# Altium project Guppy Buddy Rev B.PrjPCB (part 5 of 9)

## Sheet User Interface.SchDoc: User Interface
size Tabloid; ApprovedBy: NA; CompanyName: Cospan Design LLC; DrawnBy: David McCoy; Engineer: David McCoy; DocumentNumber: 8; Revision: A; SheetNumber: 8; SheetTotal: 18; Client: OSH; Project: Guppy Buddy; ProjectPrettyName: Guppy Buddy
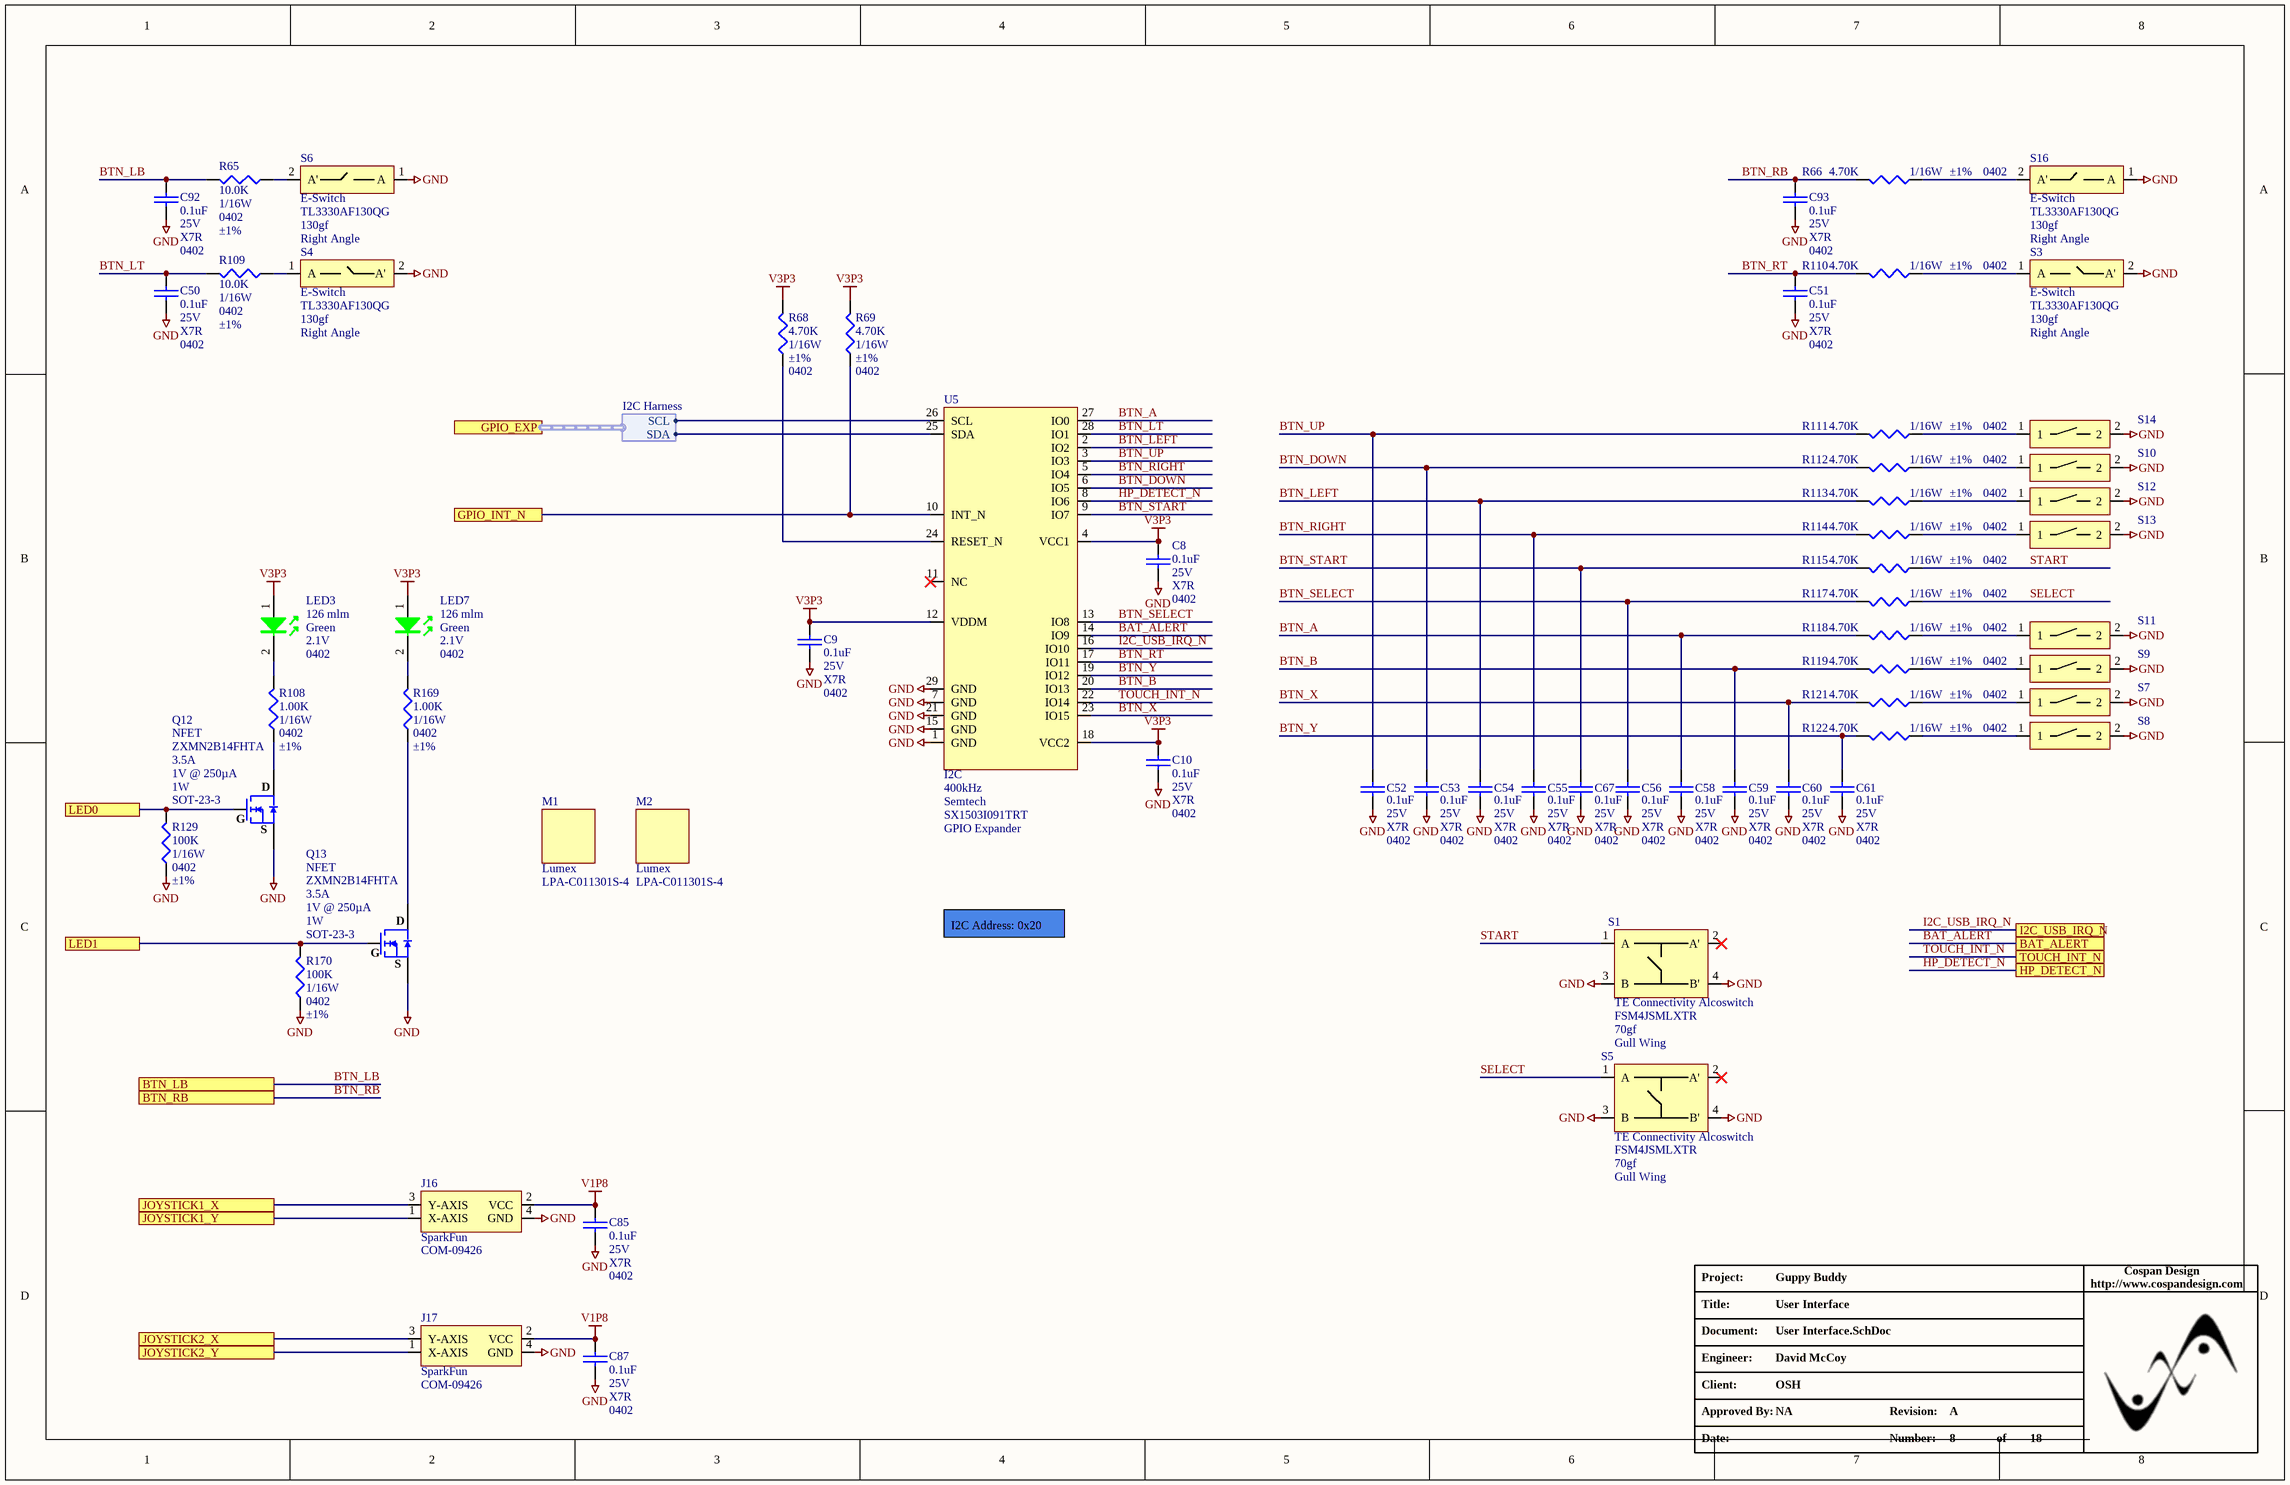
[diagram p7: User Interface.SchDoc]

### Parts
C8  Capacitance: 0.1uF  Voltage - Rated: 25V  Temperature Coefficient: X7R  Package / Case: 0402  [C_0402]  (hidden comment: C_0402_0.1UF_25V)
C9  Capacitance: 0.1uF  Voltage - Rated: 25V  Temperature Coefficient: X7R  Package / Case: 0402  [C_0402]  (hidden comment: C_0402_0.1UF_25V)
C10  Capacitance: 0.1uF  Voltage - Rated: 25V  Temperature Coefficient: X7R  Package / Case: 0402  [C_0402]  (hidden comment: C_0402_0.1UF_25V)
C50  Capacitance: 0.1uF  Voltage - Rated: 25V  Temperature Coefficient: X7R  Package / Case: 0402  [C_0402]  (hidden comment: C_0402_0.1UF_25V)
C51  Capacitance: 0.1uF  Voltage - Rated: 25V  Temperature Coefficient: X7R  Package / Case: 0402  [C_0402]  (hidden comment: C_0402_0.1UF_25V)
C52  Capacitance: 0.1uF  Voltage - Rated: 25V  Temperature Coefficient: X7R  Package / Case: 0402  [C_0402]  (hidden comment: C_0402_0.1UF_25V)
C53  Capacitance: 0.1uF  Voltage - Rated: 25V  Temperature Coefficient: X7R  Package / Case: 0402  [C_0402]  (hidden comment: C_0402_0.1UF_25V)
C54  Capacitance: 0.1uF  Voltage - Rated: 25V  Temperature Coefficient: X7R  Package / Case: 0402  [C_0402]  (hidden comment: C_0402_0.1UF_25V)
C55  Capacitance: 0.1uF  Voltage - Rated: 25V  Temperature Coefficient: X7R  Package / Case: 0402  [C_0402]  (hidden comment: C_0402_0.1UF_25V)
C56  Capacitance: 0.1uF  Voltage - Rated: 25V  Temperature Coefficient: X7R  Package / Case: 0402  [C_0402]  (hidden comment: C_0402_0.1UF_25V)
C58  Capacitance: 0.1uF  Voltage - Rated: 25V  Temperature Coefficient: X7R  Package / Case: 0402  [C_0402]  (hidden comment: C_0402_0.1UF_25V)
C59  Capacitance: 0.1uF  Voltage - Rated: 25V  Temperature Coefficient: X7R  Package / Case: 0402  [C_0402]  (hidden comment: C_0402_0.1UF_25V)
C60  Capacitance: 0.1uF  Voltage - Rated: 25V  Temperature Coefficient: X7R  Package / Case: 0402  [C_0402]  (hidden comment: C_0402_0.1UF_25V)
C61  Capacitance: 0.1uF  Voltage - Rated: 25V  Temperature Coefficient: X7R  Package / Case: 0402  [C_0402]  (hidden comment: C_0402_0.1UF_25V)
C67  Capacitance: 0.1uF  Voltage - Rated: 25V  Temperature Coefficient: X7R  Package / Case: 0402  [C_0402]  (hidden comment: C_0402_0.1UF_25V)
C85  Capacitance: 0.1uF  Voltage - Rated: 25V  Temperature Coefficient: X7R  Package / Case: 0402  [C_0402]  (hidden comment: C_0402_0.1UF_25V)
C87  Capacitance: 0.1uF  Voltage - Rated: 25V  Temperature Coefficient: X7R  Package / Case: 0402  [C_0402]  (hidden comment: C_0402_0.1UF_25V)
C92  Capacitance: 0.1uF  Voltage - Rated: 25V  Temperature Coefficient: X7R  Package / Case: 0402  [C_0402]  (hidden comment: C_0402_0.1UF_25V)
C93  Capacitance: 0.1uF  Voltage - Rated: 25V  Temperature Coefficient: X7R  Package / Case: 0402  [C_0402]  (hidden comment: C_0402_0.1UF_25V)
J16  Manufacturer 1: SparkFun  Manufacturer Part Number 1: COM-09426  [JOYSTICK_PSP1000]  (hidden comment: J_PSP1000)
J17  Manufacturer 1: SparkFun  Manufacturer Part Number 1: COM-09426  [JOYSTICK_PSP1000]  (hidden comment: J_PSP1000)
LED3  Luminous Flux @ Current - Test: 126 mlm  Color: Green  Voltage - Forward (Vf) Typ: 2.1V  Package / Case: 0402  [DIOM1005X07L_GREEN]  (hidden comment: LED_GRN_0402)
LED7  Luminous Flux @ Current - Test: 126 mlm  Color: Green  Voltage - Forward (Vf) Typ: 2.1V  Package / Case: 0402  [DIOM1005X07L_GREEN]  (hidden comment: LED_GRN_0402)
M1  Manufacturer 1: Lumex  Manufacturer Part Number 1: LPA-C011301S-4  [SINGLE_LIGHT_PIPE]  (hidden comment: M_LIGHT_PIPE)  (no BOM)
M2  Manufacturer 1: Lumex  Manufacturer Part Number 1: LPA-C011301S-4  [SINGLE_LIGHT_PIPE]  (hidden comment: M_LIGHT_PIPE)  (no BOM)
Q12  NFET  Manufacturer Part Number: ZXMN2B14FHTA  Current - Continuous Drain (Id) @ 25° C: 3.5A  Vgs(th) (Max) @ Id: 1V @ 250µA  Power - Max: 1W  Package / Case: SOT-23-3  [SOT-23A]
Q13  NFET  Manufacturer Part Number: ZXMN2B14FHTA  Current - Continuous Drain (Id) @ 25° C: 3.5A  Vgs(th) (Max) @ Id: 1V @ 250µA  Power - Max: 1W  Package / Case: SOT-23-3  [SOT-23A]
R65  Resistance In Ohms: 10.0K  Power (Watts): 1/16W  Case: 0402  Tolerance: ±1%  [R_0402]  (hidden comment: R_0402_10.0K)
R66  Resistance In Ohms: 4.70K  Power (Watts): 1/16W  Tolerance: ±1%  Case: 0402  [R_0402]  (hidden comment: 4.7k Ohms)
R68  Resistance In Ohms: 4.70K  Power (Watts): 1/16W  Tolerance: ±1%  Case: 0402  [R_0402]  (hidden comment: 4.7k Ohms)
R69  Resistance In Ohms: 4.70K  Power (Watts): 1/16W  Tolerance: ±1%  Case: 0402  [R_0402]  (hidden comment: 4.7k Ohms)
R108  Resistance In Ohms: 1.00K  Power (Watts): 1/16W  Case: 0402  Tolerance: ±1%  [R_0402]  (hidden comment: 1.0k Ohms)
R109  Resistance In Ohms: 10.0K  Power (Watts): 1/16W  Case: 0402  Tolerance: ±1%  [R_0402]  (hidden comment: R_0402_10.0K)
R110  Resistance In Ohms: 4.70K  Power (Watts): 1/16W  Tolerance: ±1%  Case: 0402  [R_0402]  (hidden comment: 4.7k Ohms)
R111  Resistance In Ohms: 4.70K  Power (Watts): 1/16W  Tolerance: ±1%  Case: 0402  [R_0402]  (hidden comment: 4.7k Ohms)
R112  Resistance In Ohms: 4.70K  Power (Watts): 1/16W  Tolerance: ±1%  Case: 0402  [R_0402]  (hidden comment: 4.7k Ohms)
R113  Resistance In Ohms: 4.70K  Power (Watts): 1/16W  Tolerance: ±1%  Case: 0402  [R_0402]  (hidden comment: 4.7k Ohms)
R114  Resistance In Ohms: 4.70K  Power (Watts): 1/16W  Tolerance: ±1%  Case: 0402  [R_0402]  (hidden comment: 4.7k Ohms)
R115  Resistance In Ohms: 4.70K  Power (Watts): 1/16W  Tolerance: ±1%  Case: 0402  [R_0402]  (hidden comment: 4.7k Ohms)
R117  Resistance In Ohms: 4.70K  Power (Watts): 1/16W  Tolerance: ±1%  Case: 0402  [R_0402]  (hidden comment: 4.7k Ohms)
R118  Resistance In Ohms: 4.70K  Power (Watts): 1/16W  Tolerance: ±1%  Case: 0402  [R_0402]  (hidden comment: 4.7k Ohms)
R119  Resistance In Ohms: 4.70K  Power (Watts): 1/16W  Tolerance: ±1%  Case: 0402  [R_0402]  (hidden comment: 4.7k Ohms)
R121  Resistance In Ohms: 4.70K  Power (Watts): 1/16W  Tolerance: ±1%  Case: 0402  [R_0402]  (hidden comment: 4.7k Ohms)
R122  Resistance In Ohms: 4.70K  Power (Watts): 1/16W  Tolerance: ±1%  Case: 0402  [R_0402]  (hidden comment: 4.7k Ohms)
R129  Resistance In Ohms: 100K  Power (Watts): 1/16W  Case: 0402  Tolerance: ±1%  [R_0402]  (hidden comment: R_0402_100.0K)
R169  Resistance In Ohms: 1.00K  Power (Watts): 1/16W  Case: 0402  Tolerance: ±1%  [R_0402]  (hidden comment: 1.0k Ohms)
R170  Resistance In Ohms: 100K  Power (Watts): 1/16W  Case: 0402  Tolerance: ±1%  [R_0402]  (hidden comment: R_0402_100.0K)
S1  Manufacturer: TE Connectivity Alcoswitch  Manufacturer Part Number: FSM4JSMLXTR  Operating Force: 70gf  Termination: Gull Wing  [TACTILE_1571563_2]  (hidden comment: S_TACTILE_1571563_2_BUTTON)
S3  Manufacturer: E-Switch  Operating Force: 130gf  Orientation: Right Angle  [TL3330AF130QG]  (hidden comment: S_TACTILE_ RA_TL3330AF130QG_BUTTON)
S4  Manufacturer: E-Switch  Operating Force: 130gf  Orientation: Right Angle  [TL3330AF130QG]  (hidden comment: S_TACTILE_ RA_TL3330AF130QG_BUTTON)
S5  Manufacturer: TE Connectivity Alcoswitch  Manufacturer Part Number: FSM4JSMLXTR  Operating Force: 70gf  Termination: Gull Wing  [TACTILE_1571563_2]  (hidden comment: S_TACTILE_1571563_2_BUTTON)
S6  Manufacturer: E-Switch  Operating Force: 130gf  Orientation: Right Angle  [TL3330AF130QG]  (hidden comment: S_TACTILE_ RA_TL3330AF130QG_BUTTON)
S7  S_GB_BTN  [GB_BUTTON]  (value not drawn)  (no BOM)
S8  S_GB_BTN  [GB_BUTTON]  (value not drawn)  (no BOM)
S9  S_GB_BTN  [GB_BUTTON]  (value not drawn)  (no BOM)
S10  S_GB_BTN  [GB_BUTTON]  (value not drawn)  (no BOM)
S11  S_GB_BTN  [GB_BUTTON]  (value not drawn)  (no BOM)
S12  S_GB_BTN  [GB_BUTTON]  (value not drawn)  (no BOM)
S13  S_GB_BTN  [GB_BUTTON]  (value not drawn)  (no BOM)
S14  S_GB_BTN  [GB_BUTTON]  (value not drawn)  (no BOM)
S16  Manufacturer: E-Switch  Operating Force: 130gf  Orientation: Right Angle  [TL3330AF130QG]  (hidden comment: S_TACTILE_ RA_TL3330AF130QG_BUTTON)
U5  Interface: I2C  Frequency: 400kHz  Manufacturer 1: Semtech  Manufacturer Part Number 1: SX1503I091TRT  Short Desc: GPIO Expander  [QFN40P400X400X60_HS-29N]  (hidden comment: U_SX1503I091TRT)

### Ports
BAT_ALERT, BTN_LB, BTN_RB, GPIO_EXP (harness I2C Harness), GPIO_INT_N, HP_DETECT_N, I2C_USB_IRQ_N, JOYSTICK1_X, JOYSTICK1_Y, JOYSTICK2_X, JOYSTICK2_Y, LED0, LED1, TOUCH_INT_N

### Harnesses
I2C Harness: SCL, SDA

### Nets
GND: C8.1 C9.1 C10.1 C50.1 C51.1 C52.1 C53.1 C54.1 C55.1 C56.1 C58.1 C59.1 C60.1 C61.1 C67.1 C85.1 C87.1 C92.1 C93.1 J16.4(GND) J17.4(GND) Q12.2(S) Q13.2(S) R129.2 R170.2 S1.3(B) S1.4(B') S3.2(A') S4.2(A') S5.3(B) S5.4(B') S6.1(A) S7.2 S8.2 S9.2 S10.2 S11.2 S12.2 S13.2 S14.2 S16.1(A) U5.1(GND) U5.7(GND) U5.15(GND) U5.21(GND) U5.29(GND)
V1P8: C85.2 C87.2 J16.2(VCC) J17.2(VCC)
V3P3: C8.2 C9.2 C10.2 LED3.1 LED7.1 R68.1 R69.1 U5.4(VCC1) U5.12(VDDM) U5.18(VCC2)
ADC0: J16.3(Y-AXIS) ; port JOYSTICK1_X
ADC1: J16.1(X-AXIS) ; port JOYSTICK1_Y
ADC2: J17.1(X-AXIS) ; port JOYSTICK2_Y
ADC3: J17.3(Y-AXIS) ; port JOYSTICK2_X
BAT_ALERT: U5.14(IO9) ; port BAT_ALERT  [project net ALERT]
BTN_A: C58.2 R118.1 U5.27(IO0)
BTN_B: C59.2 R119.1 U5.20(IO13)
BTN_DOWN: C53.2 R112.1 U5.6(IO5)
BTN_LB: C92.2 R65.1 ; port BTN_LB
BTN_LEFT: C54.2 R113.1 U5.2(IO2)
BTN_LT: C50.2 R109.1 U5.28(IO1)
BTN_RB: C93.2 R66.1 ; port BTN_RB
BTN_RIGHT: C55.2 R114.1 U5.5(IO4)
BTN_RT: C51.2 R110.1 U5.17(IO11)
BTN_SELECT: C56.2 R117.1 U5.13(IO8)
BTN_START: C67.2 R115.1 U5.9(IO7)
BTN_UP: C52.2 R111.1 U5.3(IO3)
BTN_X: C60.2 R121.1 U5.23(IO15)
BTN_Y: C61.2 R122.1 U5.19(IO12)
GPIO_INT_N: R69.2 U5.10(INT_N) ; port GPIO_INT_N
HP_DETECT_N: U5.8(IO6) ; port HP_DETECT_N
I2C0_SCL: U5.26(SCL) ; port GPIO_EXP.SCL
I2C0_SDA: U5.25(SDA) ; port GPIO_EXP.SDA
I2C_USB_IRQ_N: U5.16(IO10) ; port I2C_USB_IRQ_N
LED0: Q12.1(G) R129.1 ; port LED0
LED1: Q13.1(G) R170.1 ; port LED1
SELECT: R117.2 S5.1(A)
START: R115.2 S1.1(A)
TOUCH_INT_N: U5.22(IO14) ; port TOUCH_INT_N
NetLED3_2: LED3.2 R108.1
NetLED7_2: LED7.2 R169.1
NetQ12_3: Q12.3(D) R108.2
NetQ13_3: Q13.3(D) R169.2
NetR65_2: R65.2 S6.2(A')
NetR66_2: R66.2 S16.2(A')
NetR68_2: R68.2 U5.24(RESET_N)
NetR109_2: R109.2 S4.1(A)
NetR110_2: R110.2 S3.1(A)
NetR111_2: R111.2 S14.1
NetR112_2: R112.2 S10.1
NetR113_2: R113.2 S12.1
NetR114_2: R114.2 S13.1
NetR118_2: R118.2 S11.1
NetR119_2: R119.2 S9.1
NetR121_2: R121.2 S7.1
NetR122_2: R122.2 S8.1

Not connected (* = marked no-connect by the designer): S1 2(A')*; S5 2(A')*; U5 11(NC)*

### Notes on the sheet
- I2C Address: 0x20
- Project:
- http://www.cospandesign.com
- Cospan Design
- Document:
- Engineer:
- Title:
- Client:
- Approved By:
- Revision:
- Date:
- Number:
- of

### Library data of the parts
C8-C10 C50-C56 C58-C61 C67 C85 C87 C92 C93 = C_0402_0.1UF_25V: as C86 on sheet SOM Power; ComponentLink1URL: https://product.tdk.com/info/en/catalog/datasheets/mlcc_commercial_general_en.pdf; ComponentLink1Description: https://product.tdk.com/info/en/catalog/datasheets/mlcc_commercial_general_en.pdf; Supplier 1: Digi-Key; Supplier Part Number 1: 311-2077-1-ND; Stock 1: 0; Pricing 1: 1=0.1, 10=0.048, 100=0.0215, 500=0.01534, 1000=0.01205, 2500=0.01095, 5000=0.01007 (USD); Mount: Surface Mount; Case/Package: 0402; Case Code (Imperial): 0402; Case Code (Metric): 1005; Min Operating Temperature: -55°C; Max Operating Temperature: 125°C; Voltage Rating: 25V; Voltage Rating (DC): 25V; Packaging: Tape and Reel; Dielectric: X7R; Termination: SMD/SMT; Composition: Ceramic; Length: 1mm; Height: 0.5mm; Width: 0.02inch; Thickness: 0.022inch; Depth: 0.5mm; Radiation Hardening: No; Lead Free: Lead Free; Halogen Free: Halogen Free; ComponentLink2URL: https://datasheet.ciiva.com/11464/upy-gphc-x7r-6-3v-to-50v-8-11464889.pdf; ComponentLink2Description: https://datasheet.ciiva.com/11464/upy-gphc-x7r-6-3v-to-50v-8-11464889.pdf; ComponentLink3URL: https://datasheet.ciiva.com/13210/upy-gphc-x7r-6-3v-to-50v-8-12304-13210908.pdf; ComponentLink3Description: https://datasheet.ciiva.com/13210/upy-gphc-x7r-6-3v-to-50v-8-12304-13210908.pdf; ComponentLink4URL: https://datasheet.ciiva.com/17437/upy-gphc-x7r-6-3v-to-50v-8-17437357.pdf; ComponentLink4Description: https://datasheet.ciiva.com/17437/upy-gphc-x7r-6-3v-to-50v-8-17437357.pdf
J16 J17 = J_PSP1000: THUMB SLIDE JOYSTICK; Supplier 1: Digi-Key; Supplier Part Number 1: 1568-1848-ND; Stock 1: 0; ComponentLink1URL: https://media.digikey.com/pdf/Data%20Sheets/Sparkfun%20PDFs/COM-09426_Web.pdf; ComponentLink1Description: https://media.digikey.com/pdf/Data%20Sheets/Sparkfun%20PDFs/COM-09426_Web.pdf
LED3 LED7 = LED_GRN_0402: LED 1X0.5MM 570NM GN WTR CLR SMD; Manufacturer: Kingbright Corp; Manufacturer Part Number: APHHS1005CGCK; Current - Test: 20mA; Wavelength - Peak: 574nm; Millicandela Rating: 40mcd; Lens Type: Clear; Lens Style/Size: Rectangle, 0.8mm x 0.5mm; Viewing Angle: 120°; Supplier 1: Digi-Key; Supplier Part Number 1: 754-1101-1-ND; RoHS: RoHS Compliant; Category: Optoelectronics; Stock 1: 3400; Pricing: 1=0.24, 10=0.176, 25=0.1412, 100=0.1293, 250=0.11752, 500=0.10576, 1000=0.094 (USD); Wavelength - Dominant: 570nm; Mounting Type: Surface Mount; Packaging: Cut Tape (CT); Size / Dimension: *; Height: *; ComponentLink1URL: http://www.us.kingbright.com/images/catalog/SPEC/APHHS1005CGCK.pdf; ComponentLink1Description: http://www.us.kingbright.com/images/catalog/SPEC/APHHS1005CGCK.pdf
M1 M2 = M_LIGHT_PIPE: LIGHT PIPE 4MM SINGLE VERT SMD; Description 1: LIGHT PIPE 4MM SINGLE VERT SMD; Stock 1: 9623; Mount: Press-Fit; Colour: Clear; Material: PC,Polycarbonate; Package Quantity: 1000; Element Configuration: Single; Length: 4mm; Lead Free: Lead Free; ComponentLink1URL: https://www.lumex.com/content/files/ProductAttachment/829201730304-LPA-C011301S-X.pdf; ComponentLink1Description: https://www.lumex.com/content/files/ProductAttachment/829201730304-LPA-C011301S-X.pdf; ComponentLink2URL: http://www.farnell.com/datasheets/1423946.pdf; ComponentLink2Description: http://www.farnell.com/datasheets/1423946.pdf; ComponentLink3URL: http://www.mouser.com/ds/2/244/LPA-C011301S-4-1135475.pdf; ComponentLink3Description: http://www.mouser.com/ds/2/244/LPA-C011301S-4-1135475.pdf; Supplier 1: Digi-Key; Supplier Part Number 1: 67-2199-ND; Pricing 1: 1=1.26, 10=1.027, 25=0.79, 100=0.711, 250=0.632, 500=0.5372, 1000=0.4424, 3000=0.42028, 5000=0.4108 (USD)
Q12 Q13 = Q_NFET_3.50A_SOT23: MOSFET N-CH 20V 3.5A SOT23-3; Manufacturer: Diodes Incorporated; FET Type: N-Channel; Rds On (Max) @ Id, Vgs: 55 mOhm @ 3.5A, 4.5V; Current - Continuous Drain (Id) @ 25°C: 3.5A (Ta); Drive Voltage (Max Rds On,  Min Rds On): 1.8V, 4.5V; Gate Charge (Qg) (Max) @ Vgs: 11nC @ 4.5V; Input Capacitance (Ciss) (Max) @ Vds: 872pF @ 10V; Vgs (Max): ±8V; Power Dissipation (Max): 1W (Ta); Supplier 1: Digi-Key; Supplier Part Number 1: ZXMN2B14FHCT-ND; RoHS: RoHS Compliant; Category: Discrete Semiconductor Products; Stock 1: 1379; FET Feature: -; Drain to Source Voltage (Vdss): 20V; Mounting Type: Surface Mount; Supplier Device Package: SOT-23-3; Packaging: Cut Tape (CT); ComponentLink1URL: http://www.diodes.com/_files/datasheets/ZXMN2B14FH.pdf; ComponentLink1Description: http://www.diodes.com/_files/datasheets/ZXMN2B14FH.pdf; Pricing 1: 1=0.78, 10=0.683, 100=0.5238, 500=0.41406, 1000=0.33125 (USD); Part Status: Active; Technology: MOSFET (Metal Oxide); Operating Temperature: -55°C ~ 150°C (TJ)
R65 R109 = R_0402_10.0K: as R1-R5 on sheet SOM; Supplier 1: Digi-Key; Supplier Part Number 1: RMCF0402FT10K0CT-ND; RoHS: RoHS Compliant; Category: Resistors; Stock 1: 234525; Pricing: 1=0.04, 10=0.025, 50=0.0138, 100=0.0105, 250=0.0078, 500=0.00576, 1000=0.00384, 2500=0.00324, 5000=0.0027 (USD); Composition: Thick Film; Features: -; Package / Case: 0402 (1005 Metric); Size / Dimension: 0.039" L x 0.020" W (1.00mm x 0.50mm); Height: 0.016" (0.40mm); Number of Terminations: 2; Packaging: Cut Tape (CT); ComponentLink1URL: http://www.seielect.com/Catalog/SEI-RMCF_RMCP.pdf; ComponentLink1Description: http://www.seielect.com/Catalog/SEI-RMCF_RMCP.pdf
R66 R68 R69 R110-R115 R117-R119 R121 R122 = R_0402_4.70K: as R181 on sheet SOM Analog USB; Supplier 1: Digi-Key; Supplier Part Number 1: 311-4.7KLRCT-ND; RoHS: RoHS Compliant; Category: Resistors; Stock 1: 3610; Pricing: 10=0.014, 100=0.0063, 500=0.00382, 1000=0.0027, 5000=0.00203 (USD); Resistance (Ohms): 4.7K; Composition: Thick Film; Features: -; Package / Case: 0402 (1005 Metric); Size / Dimension: 0.039" L x 0.020" W (1.00mm x 0.50mm); Height: 0.016" (0.40mm); Number of Terminations: 2; Packaging: Cut Tape (CT); ComponentLink1URL: http://www.yageo.com/documents/recent/PYu-RC0402_51_RoHS_L_6.pdf; ComponentLink1Description: http://www.yageo.com/documents/recent/PYu-RC0402_51_RoHS_L_6.pdf
R108 R169 = R_0402_1.0K: as R51 on sheet SOM Power; Supplier 1: Digi-Key; Supplier Part Number 1: 311-1.00KLRCT-ND; RoHS: RoHS Compliant; Category: Resistors; Stock 1: 2103351; Pricing: 10=0.014, 100=0.0063, 500=0.00382, 1000=0.0027, 5000=0.00203 (USD); Composition: Thick Film; Features: -; Package / Case: 0402 (1005 Metric); Size / Dimension: 0.039" L x 0.020" W (1.00mm x 0.50mm); Height: 0.016" (0.40mm); Number of Terminations: 2; Packaging: Cut Tape (CT); ComponentLink1URL: http://www.yageo.com/documents/recent/PYu-RC0402_51_RoHS_L_6.pdf; ComponentLink1Description: http://www.yageo.com/documents/recent/PYu-RC0402_51_RoHS_L_6.pdf
R129 R170 = R_0402_100.0K: RES 100K OHM 1/16W 1% 0402 SMD; Manufacturer: Stackpole Electronics Inc; Manufacturer Part Number: RMCF0402FT100K; Temperature Coefficient: ±100ppm/°C; RoHS: RoHS Compliant; Category: Resistors; Composition: Thick Film; Features: -; Lead Style: Surface Mount (SMD - SMT); Packaging: Cut Tape (CT); Resistance (Ohms): 100k; Package / Case: 0402 (1005 Metric); Supplier Device Package: 0402; Size / Dimension: 0.039" L x 0.020" W (1.00mm x 0.50mm); Height: 0.016" (0.40mm); Number of Terminations: 2; Supplier 1: Digi-Key; Supplier Part Number 1: RMCF0402FT100KCT-ND; Stock 1: 18746; Pricing: 1=0.04, 10=0.025, 50=0.0138, 100=0.0105, 250=0.0078, 500=0.00576, 1000=0.00384, 2500=0.00324, 5000=0.0027 (USD); ComponentLink1URL: http://www.seielect.com/Catalog/SEI-RMCF_RMCP.pdf; ComponentLink1Description: http://www.seielect.com/Catalog/SEI-RMCF_RMCP.pdf
S1 S5 = S_TACTILE_1571563_2_BUTTON: SWITCH TACTILE SPST-NO 0.05A 24V; Mechanical Life: 1000000Cycles; Actuator Material: Nylon,Polyamide; Illumination Type: Non-Illuminated; Throw Configuration: SPST; Switch Travel: 0.25mm; Supplier 1: Digikey; Stock 1: 4653; Pricing 1: 1=0.68, 10=0.655, 25=0.6428, 50=0.6184, 100=0.5335, 500=0.4607, 1000=0.3637, 1200=0.3066 (USD); Min Operating Temperature: -35°C; Max Operating Temperature: 85°C; Package Quantity: 4800; Packaging: Tape and Reel; Supplier Part Number 1: 450-2057-1-ND
S3 S4 S6 S16 = S_TACTILE_ RA_TL3330AF130QG_BUTTON: SWITCH TACTILE SPST-NO 0.05A 12V; Mechanical Life: 50000Cycles; Actuator Material: Nylon,Polyamide; Throw Configuration: SPST; Contact Resistance: 100mR; Current Rating: 50mA; Illumination Type: Non-Illuminated,Illuminated; Switch Travel: 0.25mm; Actuator Length: 1mm; Supplier 1: Digikey; Stock 1: 47904; Pricing 1: 1=0.47, 10=0.448, 25=0.44, 50=0.4236, 100=0.3654, 250=0.3322, 500=0.3156, 1000=0.2492 (USD); Mount: Surface Mount; Case/Package: SMD/SMT; Contact Material: Silver; Colour: Black; Contact Plating: Silver; Min Operating Temperature: -30°C; Max Operating Temperature: 70°C; Package Quantity: 1; Packaging: Tape and Reel; Voltage Rating (DC): 12V; Max Voltage Rating (DC): 12V; Termination: Gull Wing; Electrical Life: 50000Cycles; REACH SVHC: No SVHC; Lead Free: Lead Free; ComponentLink1URL: https://datasheet.ciiva.com/2900/p010950-2900785.pdf; ComponentLink1Description: https://datasheet.ciiva.com/2900/p010950-2900785.pdf; ComponentLink2URL: https://datasheet.ciiva.com/2900/p010950-2900786.pdf; ComponentLink2Description: https://datasheet.ciiva.com/2900/p010950-2900786.pdf; ComponentLink3URL: https://datasheet.ciiva.com/2900/p010950-2900787.pdf; ComponentLink3Description: https://datasheet.ciiva.com/2900/p010950-2900787.pdf; ComponentLink4URL: https://datasheet.ciiva.com/23713/tl3330-23713381.pdf; ComponentLink4Description: https://datasheet.ciiva.com/23713/tl3330-23713381.pdf; Supplier Part Number 1: EG4388CT-ND; Manufacturer Part Number: TL3330AF130QG
U5 = U_SX1503I091TRT: IC GPIO EXPANDER I2C 16CH 28-QFN; Output Current: 24mA; Operating Supply Voltage: 5.5V; Number of I/Os: 16; Supplier 1: Digi-Key; Supplier Part Number 1: SX1503I091DKR-ND; Description 1: IC GPIO EXPANDER I2C 16CH 28-QFN; Stock 1: 17565; Pricing 1: 1=1.76, 10=1.586, 25=1.4164, 100=1.2746, 250=1.133, 500=0.99138, 1000=0.82143 (USD); Mount: Surface Mount; Case/Package: QFN; Number of Pins: 20; Min Operating Temperature: -40°C; Max Operating Temperature: 85°C; Packaging: Tape and Reel; Lead Free: Lead Free; ComponentLink1URL: https://datasheet.ciiva.com/1780/sx150x-1780208.pdf; ComponentLink1Description: https://datasheet.ciiva.com/1780/sx150x-1780208.pdf; ComponentLink2URL: https://datasheet.ciiva.com/1780/sx150x-1780209.pdf; ComponentLink2Description: https://datasheet.ciiva.com/1780/sx150x-1780209.pdf; ComponentLink3URL: https://datasheet.ciiva.com/1780/sx150x-1780210.pdf; ComponentLink3Description: https://datasheet.ciiva.com/1780/sx150x-1780210.pdf; ComponentLink4URL: https://datasheet.ciiva.com/16620/sx150x-16620398.pdf; ComponentLink4Description: https://datasheet.ciiva.com/16620/sx150x-16620398.pdf

## Sheet WIFI Bluetooth.SchDoc: WIFI/Bluetooth
size Tabloid; ApprovedBy: NA; CompanyName: Cospan Design LLC; DrawnBy: David McCoy; Engineer: David McCoy; DocumentNumber: 5; Revision: A; SheetNumber: 5; SheetTotal: 18; Client: OSH; Project: Guppy Buddy; ProjectPrettyName: Guppy Buddy
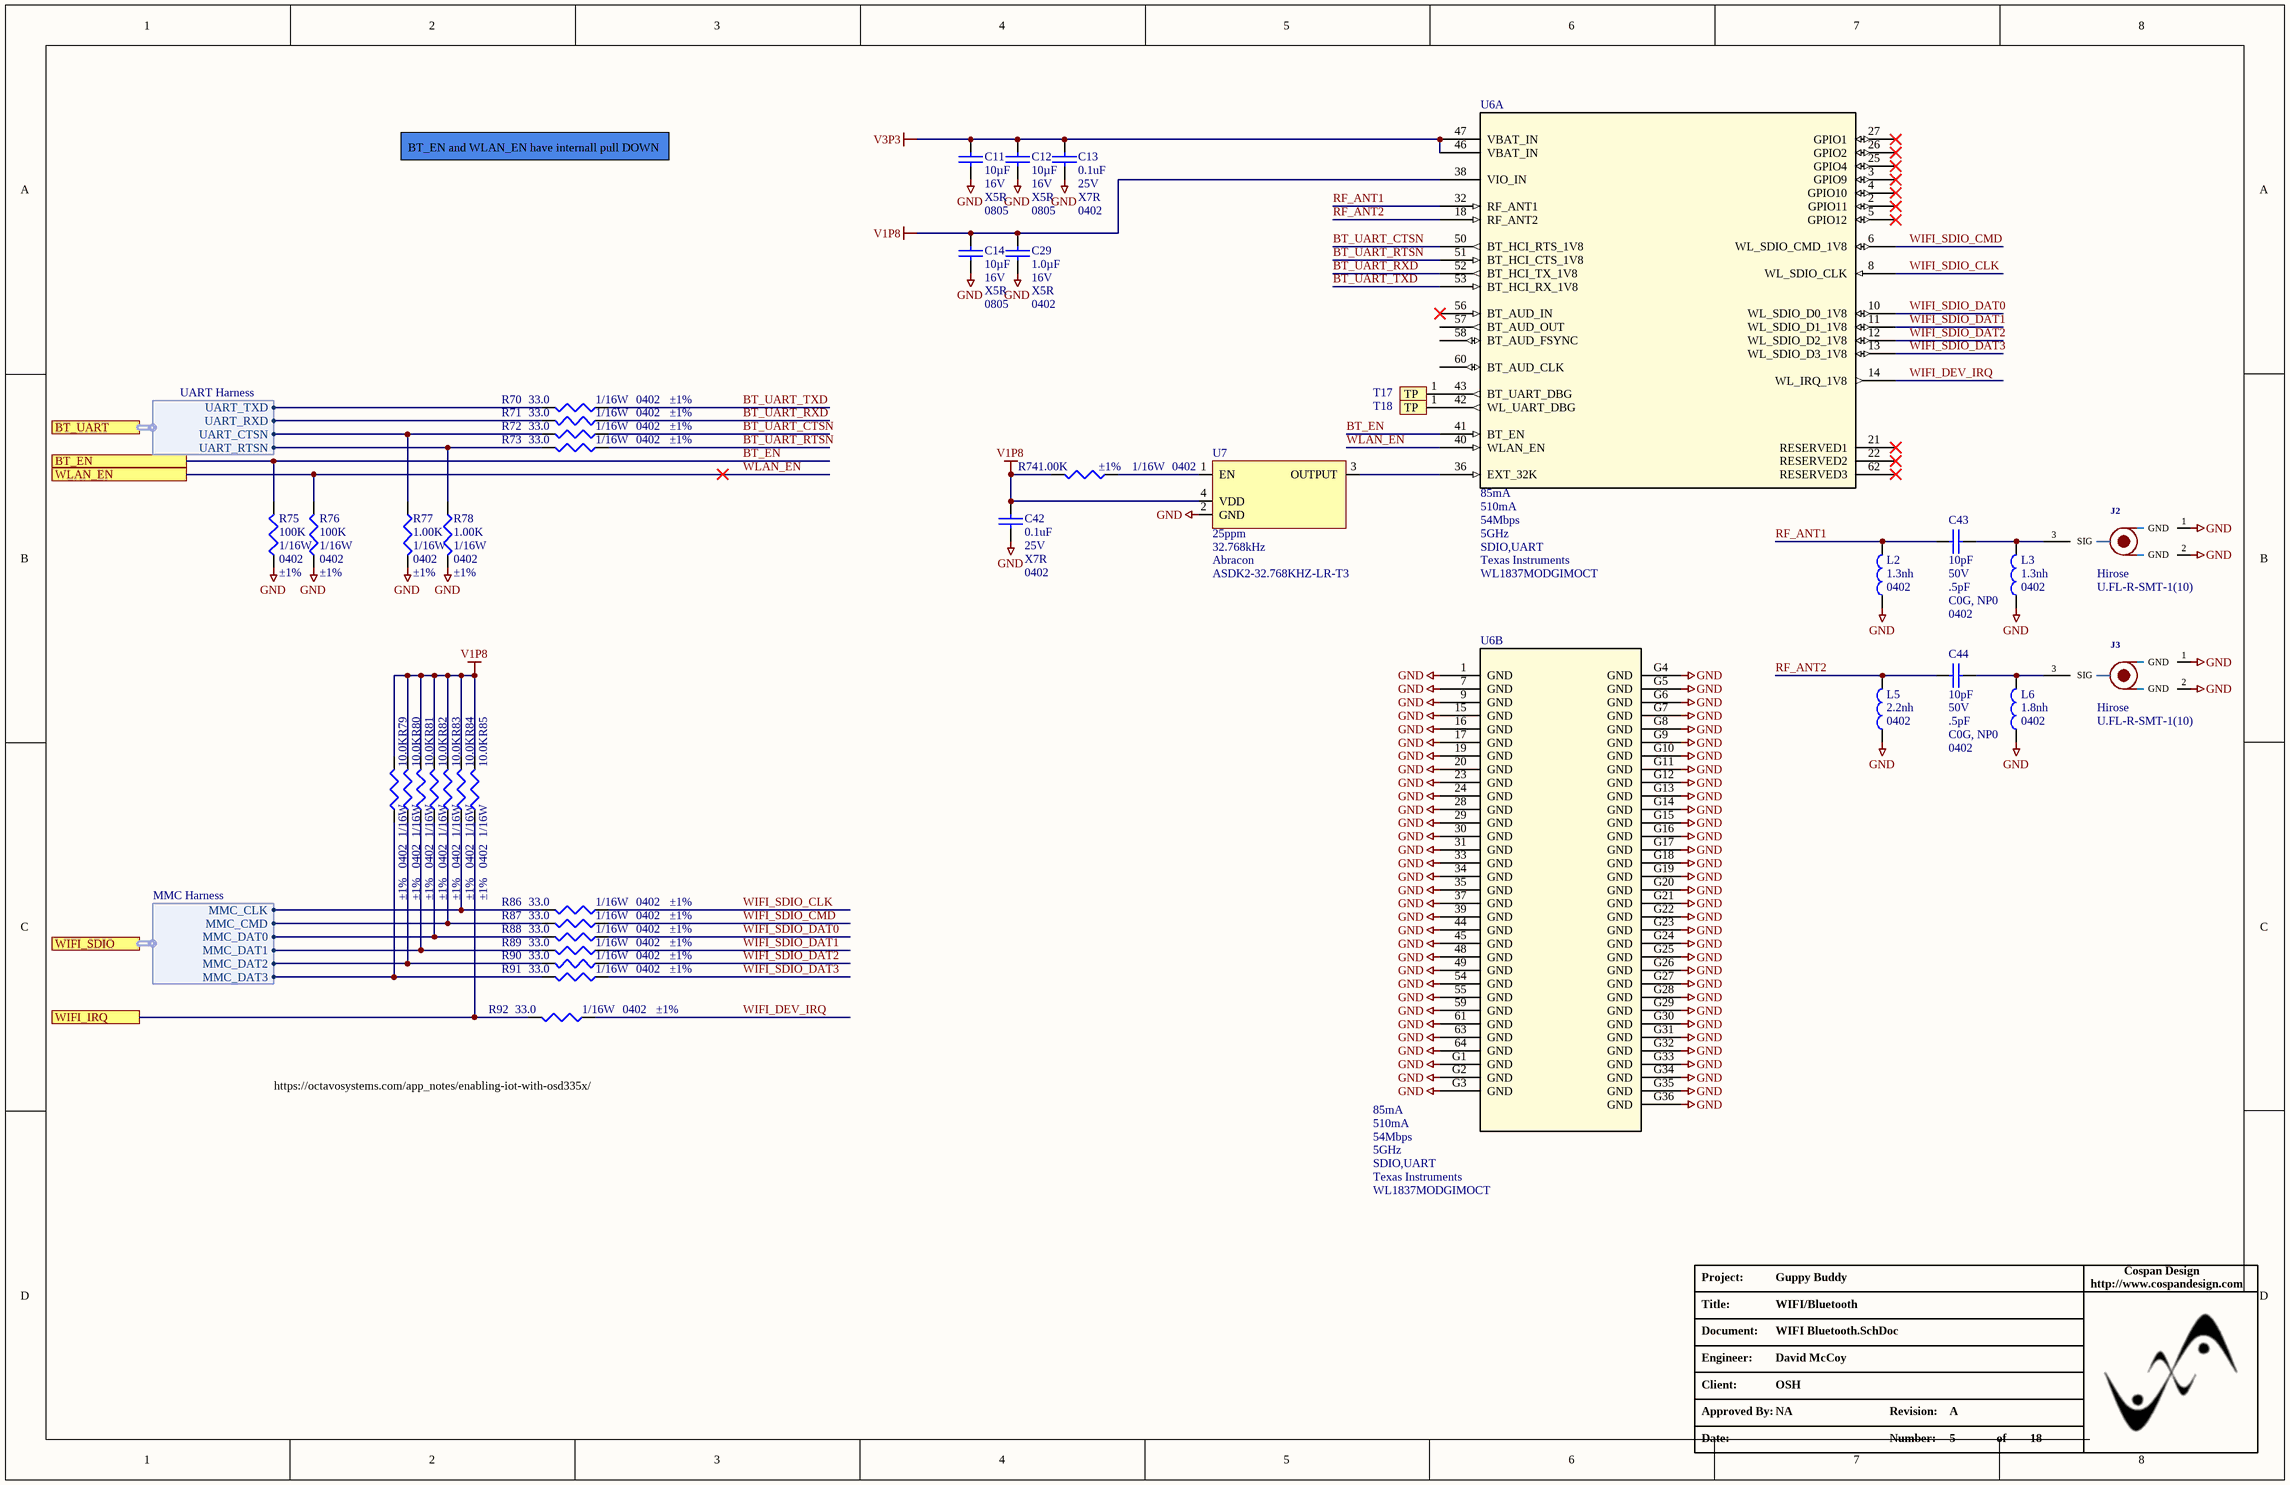
[diagram p8: WIFI Bluetooth.SchDoc]

### Parts
C11  Voltage - Rated: 16V  Temperature Coefficient: X5R  Package / Case: 0805  [C_ERA-0805]  (hidden comment: 10µF)
C12  Voltage - Rated: 16V  Temperature Coefficient: X5R  Package / Case: 0805  [C_ERA-0805]  (hidden comment: 10µF)
C13  Capacitance: 0.1uF  Voltage - Rated: 25V  Temperature Coefficient: X7R  Package / Case: 0402  [C_0402]  (hidden comment: C_0402_0.1UF_25V)
C14  Voltage - Rated: 16V  Temperature Coefficient: X5R  Package / Case: 0805  [C_ERA-0805]  (hidden comment: 10µF)
C29  Capacitance: 1.0µF  Voltage - Rated: 16V  Temperature Coefficient: X5R  Package / Case: 0402  [C_0402]  (hidden comment: 1.0uF)
C42  Capacitance: 0.1uF  Voltage - Rated: 25V  Temperature Coefficient: X7R  Package / Case: 0402  [C_0402]  (hidden comment: C_0402_0.1UF_25V)
C43  Voltage - Rated: 50V  Tolerance: .5pF  Temperature Coefficient: C0G, NP0  Package / Case: 0402  [C_0402]  (hidden comment: 10pF)
C44  Voltage - Rated: 50V  Tolerance: .5pF  Temperature Coefficient: C0G, NP0  Package / Case: 0402  [C_0402]  (hidden comment: 10pF)
J2  Manufacturer 1: Hirose  [U.FL-R-SMT-1]  (hidden comment: U.FL-R-SMT-1(10))
J3  Manufacturer 1: Hirose  [U.FL-R-SMT-1]  (hidden comment: U.FL-R-SMT-1(10))
L2  Inductance: 1.3nh  Case Code (Imperial): 0402  [R_0402]  (hidden comment: L_0402_1.3nH)
L3  Inductance: 1.3nh  Case Code (Imperial): 0402  [R_0402]  (hidden comment: L_0402_1.3nH)
L5  Inductance: 2.2nh  Case Code (Imperial): 0402  [R_0402]  (hidden comment: L_0402_2.2nH)
L6  Inductance: 1.8nh  Case Code (Imperial): 0402  [R_0402]  (hidden comment: L_0402_1.8nH)
R70  Resistance In Ohms: 33.0  Power (Watts): 1/16W  Case: 0402  Tolerance: ±1%  [R_0402]  (hidden comment: R_0402_33)
R71  Resistance In Ohms: 33.0  Power (Watts): 1/16W  Case: 0402  Tolerance: ±1%  [R_0402]  (hidden comment: R_0402_33)
R72  Resistance In Ohms: 33.0  Power (Watts): 1/16W  Case: 0402  Tolerance: ±1%  [R_0402]  (hidden comment: R_0402_33)
R73  Resistance In Ohms: 33.0  Power (Watts): 1/16W  Case: 0402  Tolerance: ±1%  [R_0402]  (hidden comment: R_0402_33)
R74  Resistance In Ohms: 1.00K  Power (Watts): 1/16W  Case: 0402  Tolerance: ±1%  [R_0402]  (hidden comment: 1.0k Ohms)
R75  Resistance In Ohms: 100K  Power (Watts): 1/16W  Case: 0402  Tolerance: ±1%  [R_0402]  (hidden comment: R_0402_100.0K)
R76  Resistance In Ohms: 100K  Power (Watts): 1/16W  Case: 0402  Tolerance: ±1%  [R_0402]  (hidden comment: R_0402_100.0K)
R77  Resistance In Ohms: 1.00K  Power (Watts): 1/16W  Case: 0402  Tolerance: ±1%  [R_0402]  (hidden comment: 1.0k Ohms)
R78  Resistance In Ohms: 1.00K  Power (Watts): 1/16W  Case: 0402  Tolerance: ±1%  [R_0402]  (hidden comment: 1.0k Ohms)
R79  Resistance In Ohms: 10.0K  Power (Watts): 1/16W  Case: 0402  Tolerance: ±1%  [R_0402]  (hidden comment: R_0402_10.0K)
R80  Resistance In Ohms: 10.0K  Power (Watts): 1/16W  Case: 0402  Tolerance: ±1%  [R_0402]  (hidden comment: R_0402_10.0K)
R81  Resistance In Ohms: 10.0K  Power (Watts): 1/16W  Case: 0402  Tolerance: ±1%  [R_0402]  (hidden comment: R_0402_10.0K)
R82  Resistance In Ohms: 10.0K  Power (Watts): 1/16W  Case: 0402  Tolerance: ±1%  [R_0402]  (hidden comment: R_0402_10.0K)
R83  Resistance In Ohms: 10.0K  Power (Watts): 1/16W  Case: 0402  Tolerance: ±1%  [R_0402]  (hidden comment: R_0402_10.0K)
R84  Resistance In Ohms: 10.0K  Power (Watts): 1/16W  Case: 0402  Tolerance: ±1%  [R_0402]  (hidden comment: R_0402_10.0K)
R85  Resistance In Ohms: 10.0K  Power (Watts): 1/16W  Case: 0402  Tolerance: ±1%  [R_0402]  (hidden comment: R_0402_10.0K)
R86  Resistance In Ohms: 33.0  Power (Watts): 1/16W  Case: 0402  Tolerance: ±1%  [R_0402]  (hidden comment: R_0402_33)
R87  Resistance In Ohms: 33.0  Power (Watts): 1/16W  Case: 0402  Tolerance: ±1%  [R_0402]  (hidden comment: R_0402_33)
R88  Resistance In Ohms: 33.0  Power (Watts): 1/16W  Case: 0402  Tolerance: ±1%  [R_0402]  (hidden comment: R_0402_33)
R89  Resistance In Ohms: 33.0  Power (Watts): 1/16W  Case: 0402  Tolerance: ±1%  [R_0402]  (hidden comment: R_0402_33)
R90  Resistance In Ohms: 33.0  Power (Watts): 1/16W  Case: 0402  Tolerance: ±1%  [R_0402]  (hidden comment: R_0402_33)
R91  Resistance In Ohms: 33.0  Power (Watts): 1/16W  Case: 0402  Tolerance: ±1%  [R_0402]  (hidden comment: R_0402_33)
R92  Resistance In Ohms: 33.0  Power (Watts): 1/16W  Case: 0402  Tolerance: ±1%  [R_0402]  (hidden comment: R_0402_33)
T17  TEST_POINT_SMALL  [TestPointSmall]  (value not drawn)  (no BOM)
T18  TEST_POINT_SMALL  [TestPointSmall]  (value not drawn)  (no BOM)
U6  Current - Receiving: 85mA  Current - Transmitting: 510mA  Data Rate: 54Mbps  Frequency: 5GHz  Interface: SDIO,UART  Manufacturer 1: Texas Instruments  Manufacturer Part Number 1: WL1837MODGIMOCT  [MOC0100A]  (hidden comment: U_WL1837MODGIMOCT)  (parts A,B of 2)
U7  Frequency Stability: 25ppm  Frequency: 32.768kHz  Manufacturer 1: Abracon  Manufacturer Part Number 1: ASDK2-32.768KHZ-LR-T3  [KC2520B]  (hidden comment: U_ASDK2-32.768KHZ-LR-T3)

### Ports
BT_EN, BT_UART (harness UART Harness), WIFI_IRQ, WIFI_SDIO (harness MMC Harness), WLAN_EN

### Harnesses
UART Harness: UART_TXD, UART_RXD, UART_CTSN, UART_RTSN
MMC Harness: MMC_CLK, MMC_CMD, MMC_DAT0, MMC_DAT1, MMC_DAT2, MMC_DAT3

### Nets
GND: C11.1 C12.1 C13.1 C14.1 C29.1 C42.1 J2.1(GND) J2.2(GND) J3.1(GND) J3.2(GND) L2.1 L3.1 L5.1 L6.1 R75.2 R76.2 R77.1 R78.1 U6.1(GND) U6.7(GND) U6.9(GND) U6.15(GND) U6.16(GND) U6.17(GND) U6.19(GND) U6.20(GND) U6.23(GND) U6.24(GND) U6.28(GND) U6.29(GND) U6.30(GND) U6.31(GND) U6.33(GND) U6.34(GND) U6.35(GND) U6.37(GND) U6.39(GND) U6.44(GND) U6.45(GND) U6.48(GND) U6.49(GND) U6.54(GND) U6.55(GND) U6.59(GND) U6.61(GND) U6.63(GND) U6.64(GND) U6.G1(GND) U6.G2(GND) U6.G3(GND) U6.G4(GND) U6.G5(GND) U6.G6(GND) U6.G7(GND) U6.G8(GND) U6.G9(GND) U6.G10(GND) U6.G11(GND) U6.G12(GND) U6.G13(GND) U6.G14(GND) U6.G15(GND) U6.G16(GND) U6.G17(GND) U6.G18(GND) U6.G19(GND) U6.G20(GND) U6.G21(GND) U6.G22(GND) U6.G23(GND) U6.G24(GND) U6.G25(GND) U6.G26(GND) U6.G27(GND) U6.G28(GND) U6.G29(GND) U6.G30(GND) U6.G31(GND) U6.G32(GND) U6.G33(GND) U6.G34(GND) U6.G35(GND) U6.G36(GND) U7.2(GND)
V1P8: C14.2 C29.2 C42.2 R74.1 R79.1 R80.1 R81.1 R82.1 R83.1 R84.1 R85.1 U6.38(VIO_IN) U7.4(VDD)
V3P3: C11.2 C12.2 C13.2 U6.46(VBAT_IN) U6.47(VBAT_IN)
BT_EN: R75.1 U6.41(BT_EN) ; port BT_EN
BT_UART_CTSN: R72.2 U6.50(BT_HCI_RTS_1V8)
BT_UART_RTSN: R73.2 U6.51(BT_HCI_CTS_1V8)
BT_UART_RXD: R71.2 U6.52(BT_HCI_TX_1V8)
BT_UART_TXD: R70.2 U6.53(BT_HCI_RX_1V8)
MMC2_CLK: R84.2 R86.1 ; port WIFI_SDIO.MMC_CLK
MMC2_CMD: R83.2 R87.1 ; port WIFI_SDIO.MMC_CMD
MMC2_DAT0: R82.2 R88.1 ; port WIFI_SDIO.MMC_DAT0
MMC2_DAT1: R81.2 R89.1 ; port WIFI_SDIO.MMC_DAT1
MMC2_DAT2: R80.2 R90.1 ; port WIFI_SDIO.MMC_DAT2
MMC2_DAT3: R79.2 R91.1 ; port WIFI_SDIO.MMC_DAT3
RF_ANT1: C43.2 L2.2 U6.32(RF_ANT1)
RF_ANT2: C44.2 L5.2 U6.18(RF_ANT2)
UART3_CTSN: R72.1 R77.2 ; port BT_UART.UART_CTSN
UART3_RTSN: R73.1 R78.2 ; port BT_UART.UART_RTSN
UART3_RXD: R71.1 ; port BT_UART.UART_RXD
UART3_TXD: R70.1 ; port BT_UART.UART_TXD
WIFI_DEV_IRQ: R92.2 U6.14(WL_IRQ_1V8)
WIFI_IRQ: R85.2 R92.1 ; port WIFI_IRQ
WIFI_SDIO_CLK: R86.2 U6.8(WL_SDIO_CLK)
WIFI_SDIO_CMD: R87.2 U6.6(WL_SDIO_CMD_1V8)
WIFI_SDIO_DAT0: R88.2 U6.10(WL_SDIO_D0_1V8)
WIFI_SDIO_DAT1: R89.2 U6.11(WL_SDIO_D1_1V8)
WIFI_SDIO_DAT2: R90.2 U6.12(WL_SDIO_D2_1V8)
WIFI_SDIO_DAT3: R91.2 U6.13(WL_SDIO_D3_1V8)
WLAN_EN: R76.1 U6.40(WLAN_EN) ; port WLAN_EN
NetC43_1: C43.1 J2.3(SIG) L3.2
NetC44_1: C44.1 J3.3(SIG) L6.2
NetR74_2: R74.2 U7.1(EN)
NetT17_1: T17.1(TP) U6.43(BT_UART_DBG)
NetT18_1: T18.1(TP) U6.42(WL_UART_DBG)
NetU6_36: U6.36(EXT_32K) U7.3(OUTPUT)

Not connected (* = marked no-connect by the designer): U6 2(GPIO11)* 3(GPIO9)* 4(GPIO10)* 5(GPIO12)* 21(RESERVED1)* 22(RESERVED2)* 25(GPIO4)* 26(GPIO2)* 27(GPIO1)* 56(BT_AUD_IN)* 57(BT_AUD_OUT) 58(BT_AUD_FSYNC) 60(BT_AUD_CLK) 62(RESERVED3)*

### Notes on the sheet
- BT_EN and WLAN_EN have internall pull DOWN
- https://octavosystems.com/app_notes/enabling-iot-with-osd335x/
- Project:
- http://www.cospandesign.com
- Cospan Design
- Document:
- Engineer:
- Title:
- Client:
- Approved By:
- Revision:
- Date:
- Number:
- of

### Library data of the parts
C11 C12 C14 = C_0805_10UF_16V: CAP CER 10uF 16V X5R 20% 0805; Manufacturer: Taiyo Yuden; Manufacturer Part Number: EMK212BJ106KG-T; Tolerance: ±10%; Supplier 1: Digi-Key; RoHS: RoHS Compliant; Category: Capacitors; Stock 1: 2052124; Pricing 1: 1=0.2, 10=0.139, 100=0.0656, 500=0.04596, 1000=0.03805 (USD); Packaging: Cut Tape (CT); Part Status: Active; Operating Temperature: -55°C ~ 85°C; Features: -; Ratings: -; Applications: General Purpose; Mounting Type: Surface Mount, MLCC; Size / Dimension: 0.079" L x 0.049" W (2.00mm x 1.25mm); Height - Seated (Max): -; Thickness (Max): 0.053" (1.35mm); Lead Spacing: -; Lead Style: -; ComponentLink1URL: http://www.yuden.co.jp/productdata/catalog/en/mlcc01_e.pdf; ComponentLink1Description: http://www.yuden.co.jp/productdata/catalog/en/mlcc01_e.pdf; Supplier Part Number 1: 587-1295-1-ND; Capacitance: 10µF
C13 C42 = C_0402_0.1UF_25V: as C86 on sheet SOM Power; ComponentLink1URL: https://product.tdk.com/info/en/catalog/datasheets/mlcc_commercial_general_en.pdf; ComponentLink1Description: https://product.tdk.com/info/en/catalog/datasheets/mlcc_commercial_general_en.pdf; Supplier 1: Digi-Key; Supplier Part Number 1: 311-2077-1-ND; Stock 1: 0; Pricing 1: 1=0.1, 10=0.048, 100=0.0215, 500=0.01534, 1000=0.01205, 2500=0.01095, 5000=0.01007 (USD); Mount: Surface Mount; Case/Package: 0402; Case Code (Imperial): 0402; Case Code (Metric): 1005; Min Operating Temperature: -55°C; Max Operating Temperature: 125°C; Voltage Rating: 25V; Voltage Rating (DC): 25V; Packaging: Tape and Reel; Dielectric: X7R; Termination: SMD/SMT; Composition: Ceramic; Length: 1mm; Height: 0.5mm; Width: 0.02inch; Thickness: 0.022inch; Depth: 0.5mm; Radiation Hardening: No; Lead Free: Lead Free; Halogen Free: Halogen Free; ComponentLink2URL: https://datasheet.ciiva.com/11464/upy-gphc-x7r-6-3v-to-50v-8-11464889.pdf; ComponentLink2Description: https://datasheet.ciiva.com/11464/upy-gphc-x7r-6-3v-to-50v-8-11464889.pdf; ComponentLink3URL: https://datasheet.ciiva.com/13210/upy-gphc-x7r-6-3v-to-50v-8-12304-13210908.pdf; ComponentLink3Description: https://datasheet.ciiva.com/13210/upy-gphc-x7r-6-3v-to-50v-8-12304-13210908.pdf; ComponentLink4URL: https://datasheet.ciiva.com/17437/upy-gphc-x7r-6-3v-to-50v-8-17437357.pdf; ComponentLink4Description: https://datasheet.ciiva.com/17437/upy-gphc-x7r-6-3v-to-50v-8-17437357.pdf
C29 = C_0402_1.0UF_16V: CAP CER 1.0UF 16V X5R 0402; Manufacturer 1: Samsung; Manufacturer Part Number 1: CL05A105KO5NNNC; Tolerance: 10%; Description 1: Cap Ceramic 1uF 16V X5R 10% SMD 0402 85C Paper T/R; Supplier 1: Digi-Key; Stock 1: 26908; Pricing 1: 1=0.1, 10=0.062, 100=0.0276, 500=0.01968, 1000=0.01547, 2500=0.01406, 5000=0.01294 (USD); Packaging: Tape and Reel; ComponentLink1URL: http://ds.yuden.co.jp/TYCOMPAS/ut/detail.do?productNo=EMK105BJ105KV-F&fileName=EMK105BJ105KV-F_SS&mode=specSheetDownload; ComponentLink1Description: http://ds.yuden.co.jp/TYCOMPAS/ut/detail.do?productNo=EMK105BJ105KV-F&fileName=EMK105BJ105KV-F_SS&mode=specSheetDownload; Supplier Part Number 1: 1276-1067-6-ND; ComponentLink2URL: https://datasheet.ciiva.com/16207/cl05a105ko5nnnc-16207571.pdf; ComponentLink2Description: https://datasheet.ciiva.com/16207/cl05a105ko5nnnc-16207571.pdf; ComponentLink3URL: https://datasheet.ciiva.com/15195/getdatasheetpartid-355272-15195629.pdf; ComponentLink3Description: https://datasheet.ciiva.com/15195/getdatasheetpartid-355272-15195629.pdf; Mount: Surface Mount; Case/Package: 0402; Case Code (Metric): 1005; Case Code (Imperial): 0402; Contact Plating: Tin; Min Operating Temperature: -55°C; Max Operating Temperature: 85°C; Dielectric: X5R; Package Quantity: 1; Voltage Rating: 16V; Voltage: 16V; Length: 1mm; Height: 0.5mm; Width: 0.02inch; Thickness: 0.022inch; Depth: 0.5mm; Radiation Hardening: No
C43 C44 = C_0402_10PF_50V: CAP CER 10PF 50V NP0 0402; Manufacturer: Taiyo Yuden; Manufacturer Part Number: UMK105CG100DV-F; Supplier 1: Digi-Key; Supplier Part Number 1: 587-1947-1-ND; RoHS: RoHS Compliant; Category: Capacitors; Stock 1: 47289; Pricing: 1=0.07, 10=0.045, 50=0.0216, 100=0.0162, 250=0.01172, 500=0.00864, 1000=0.00585, 5000=0.0045 (USD); Mounting Type: Surface Mount, MLCC; Operating Temperature: -55°C ~ 125°C; Applications: General Purpose; Ratings: -; Size / Dimension: 0.039" L x 0.020" W (1.00mm x 0.50mm); Height - Seated (Max): -; Thickness (Max): 0.022" (0.55mm); Lead Spacing: -; Features: -; Packaging: Cut Tape (CT); Lead Style: -; ComponentLink1URL: http://www.yuden.co.jp/productdata/catalog/en/mlcc02_e.pdf; ComponentLink1Description: http://www.yuden.co.jp/productdata/catalog/en/mlcc02_e.pdf; Capacitance: 10pF
J2 J3 = J_U.FL-R-SMT-1: CONN UMC JACK STR 50 OHM SMD; GateName_1: G$1; Body Plating: Silver; Body Material: Bronze; Dielectric Material: Polymer; Impedance: 50R; Connector Type: Receptacle,Coaxial,Male Pin; Max Frequency: 6GHz; Gender: Male; Wire/Cable Type: Coaxial; Insulation Resistance: 500MR; SymbolName_1: U.FL-R-SMT-1; LibraryName: GHI-Connectors; DeviceSetName: U.FL-R-SMT-1; Supplier 1: Digi-Key; Supplier Part Number 1: H11891DKR-ND; Description 1: CONN UMC JACK STR 50 OHM SMD; Stock 1: 382010; Pricing 1: 1=1.31, 10=1.15, 25=1.0824, 50=1.0374, 100=0.9922, 250=0.902, 500=0.8118, 1000=0.7216 (USD); Mount: Surface Mount,Through Hole,PCB; Contact Material: Bronze,Brass; Contact Plating: Gold; Housing Colour: Beige; Min Operating Temperature: -40°C; Max Operating Temperature: 90°C; Packaging: Tape and Reel; Package Quantity: 2500; Termination: Solder; Fastening Type: Snap; Orientation: Straight; Frequency: 6GHz; Length: 3mm; Depth: 3.1mm; Radiation Hardening: No; Lead Free: Lead Free; REACH SVHC: No SVHC; ComponentLink1URL: https://datasheet.ciiva.com/7651/91524-7651914.pdf; ComponentLink1Description: https://datasheet.ciiva.com/7651/91524-7651914.pdf; ComponentLink2URL: https://datasheet.ciiva.com/11762/0900766b8105243f-11762474.pdf; ComponentLink2Description: https://datasheet.ciiva.com/11762/0900766b8105243f-11762474.pdf; ComponentLink3URL: https://datasheet.ciiva.com/7651/91524-7651915.pdf; ComponentLink3Description: https://datasheet.ciiva.com/7651/91524-7651915.pdf; NAME: *; Manufacturer Part Number 1: U.FL-R-SMT-1(10)
L2 L3 = L_0402_1.3nH: FIXED IND 1.3NH 1A 90 MOHM; Manufacturer 1: Murata; Manufacturer Part Number 1: LQG15HS1N3S02D; Description 1: Inductor RF Chip Multi-Layer 1.3nH 0.3nH 100MHz 8Q-Factor Air 300mA 90mOhm DCR 0402 Paper T/R; Core Material: Air; Q Factor: 8; Self Resonant Frequency: 6GHz; Shielding: Unshielded; Current Rating: 300mA; Tolerance: 5%; DC Resistance (DCR): 90mR; Test Frequency: 100MHz; ComponentLink1URL: http://search.murata.co.jp/Ceramy/image/img/PDF/ENG/L0075S0084LQP15M.pdf; ComponentLink1Description: http://search.murata.co.jp/Ceramy/image/img/PDF/ENG/L0075S0084LQP15M.pdf; ComponentLink2URL: https://datasheet.ciiva.com/8510/l0075s0083lqg15hs-8510837.pdf; ComponentLink2Description: https://datasheet.ciiva.com/8510/l0075s0083lqg15hs-8510837.pdf; ComponentLink3URL: https://datasheet.ciiva.com/4977/o05e-4977799.pdf; ComponentLink3Description: https://datasheet.ciiva.com/4977/o05e-4977799.pdf; ComponentLink4URL: https://datasheet.ciiva.com/6690/l0075s0083lqg15hs-6690759.pdf; ComponentLink4Description: https://datasheet.ciiva.com/6690/l0075s0083lqg15hs-6690759.pdf; ComponentLink5URL: https://datasheet.ciiva.com/6690/l0075s0083lqg15hs-6690762.pdf; ComponentLink5Description: https://datasheet.ciiva.com/6690/l0075s0083lqg15hs-6690762.pdf; ComponentLink6URL: https://datasheet.ciiva.com/6690/l0075s0083lqg15hs-6690763.pdf; ComponentLink6Description: https://datasheet.ciiva.com/6690/l0075s0083lqg15hs-6690763.pdf; ComponentLink7URL: https://datasheet.ciiva.com/11801/0900766b80f10809-11801404.pdf; ComponentLink7Description: https://datasheet.ciiva.com/11801/0900766b80f10809-11801404.pdf; ComponentLink8URL: https://datasheet.ciiva.com/17247/l0075s0083lqg15hs-17247117.pdf; ComponentLink8Description: https://datasheet.ciiva.com/17247/l0075s0083lqg15hs-17247117.pdf; Supplier 1: Digi-Key; Supplier Part Number 1: 490-6568-6-ND; Stock 1: 37779; Pricing 1: 1=0.1, 10=0.061, 100=0.0404, 500=0.03366, 1000=0.02827, 2500=0.02423 (USD); Mount: Surface Mount; Case/Package: 0402; Case Code (Metric): 1005; Min Operating Temperature: -55°C; Max Operating Temperature: 125°C; Packaging: Tape and Reel; Package Quantity: 10000; Max DC Current: 300mA; Termination: SMD/SMT; Current: 300mA; DC Current: 300mA; Military Standard: Not; Length: 1mm; Height: 0.5mm; Width: 0.5mm; Height - Seated (Max): 0.022inch; Depth: 0.55mm; Radiation Hardening: No; ComponentLink9URL: https://datasheet.ciiva.com/17279/l0075s0083lqg15hs-17279241.pdf; ComponentLink9Description: https://datasheet.ciiva.com/17279/l0075s0083lqg15hs-17279241.pdf; ComponentLink10URL: https://datasheet.ciiva.com/6705/l0075s0083lqg15hs-6705242.pdf; ComponentLink10Description: https://datasheet.ciiva.com/6705/l0075s0083lqg15hs-6705242.pdf; ComponentLink11URL: https://datasheet.ciiva.com/6705/l0075s0083lqg15hs-6705243.pdf; ComponentLink11Description: https://datasheet.ciiva.com/6705/l0075s0083lqg15hs-6705243.pdf; ComponentLink12URL: https://datasheet.ciiva.com/6705/l0075s0083lqg15hs-6705244.pdf; ComponentLink12Description: https://datasheet.ciiva.com/6705/l0075s0083lqg15hs-6705244.pdf; ComponentLink13URL: https://datasheet.ciiva.com/11801/0900766b8090d53b-11801407.pdf; ComponentLink13Description: https://datasheet.ciiva.com/11801/0900766b8090d53b-11801407.pdf
L5 = L_0402_2.2nH: FIXED IND 2.2NH 950MA 150 MOHM; Manufacturer 1: Murata; Manufacturer Part Number 1: LQG15HN2N2S02D; Description 1: FIXED IND 2.2NH 300MA 150 MOHM; Core Material: Air; Current Rating: 300mA; Shielding: Unshielded; Q Factor: 8; Self Resonant Frequency: 6GHz; DC Resistance (DCR): 150mR; Test Frequency: 100MHz; ComponentLink1URL: http://search.murata.co.jp/Ceramy/image/img/PDF/ENG/L0075S0084LQP15M.pdf; ComponentLink1Description: http://search.murata.co.jp/Ceramy/image/img/PDF/ENG/L0075S0084LQP15M.pdf; ComponentLink2URL: https://datasheet.ciiva.com/8510/l0075s0083lqg15hs-8510837.pdf; ComponentLink2Description: https://datasheet.ciiva.com/8510/l0075s0083lqg15hs-8510837.pdf; ComponentLink3URL: https://datasheet.ciiva.com/4977/o05e-4977799.pdf; ComponentLink3Description: https://datasheet.ciiva.com/4977/o05e-4977799.pdf; ComponentLink4URL: https://datasheet.ciiva.com/6690/l0075s0083lqg15hs-6690759.pdf; ComponentLink4Description: https://datasheet.ciiva.com/6690/l0075s0083lqg15hs-6690759.pdf; ComponentLink5URL: https://datasheet.ciiva.com/6690/l0075s0083lqg15hs-6690762.pdf; ComponentLink5Description: https://datasheet.ciiva.com/6690/l0075s0083lqg15hs-6690762.pdf; ComponentLink6URL: https://datasheet.ciiva.com/6690/l0075s0083lqg15hs-6690763.pdf; ComponentLink6Description: https://datasheet.ciiva.com/6690/l0075s0083lqg15hs-6690763.pdf; ComponentLink7URL: https://datasheet.ciiva.com/11801/0900766b80f10809-11801404.pdf; ComponentLink7Description: https://datasheet.ciiva.com/11801/0900766b80f10809-11801404.pdf; ComponentLink8URL: https://datasheet.ciiva.com/17247/l0075s0083lqg15hs-17247117.pdf; ComponentLink8Description: https://datasheet.ciiva.com/17247/l0075s0083lqg15hs-17247117.pdf; Supplier 1: Digi-Key; Supplier Part Number 1: 490-1077-6-ND; Stock 1: 13661; Pricing 1: 1=0.1, 10=0.061, 100=0.0404, 500=0.03366, 1000=0.02827, 2500=0.02423 (USD); Mount: Surface Mount; Case/Package: 0402; Number of Pins: 2; Case Code (Metric): 1005; Min Operating Temperature: -55°C; Max Operating Temperature: 125°C; Package Quantity: 10000; Packaging: Tape and Reel; Max DC Current: 300mA; Termination: SMD/SMT; DC Current: 300mA; Military Standard: Not; Length: 1mm; Height: 0.02inch; Width: 0.02inch; Height - Seated (Max): 0.022inch; Depth: 0.55mm; Radiation Hardening: No; REACH SVHC: No SVHC; Lead Free: Lead Free; ComponentLink9URL: https://datasheet.ciiva.com/1063/l0075s0083lqg15hn-1063840.pdf; ComponentLink9Description: https://datasheet.ciiva.com/1063/l0075s0083lqg15hn-1063840.pdf; ComponentLink10URL: https://datasheet.ciiva.com/11801/0900766b80f10808-11801393.pdf; ComponentLink10Description: https://datasheet.ciiva.com/11801/0900766b80f10808-11801393.pdf; ComponentLink11URL: https://datasheet.ciiva.com/8002/66026-8002501.pdf; ComponentLink11Description: https://datasheet.ciiva.com/8002/66026-8002501.pdf; ComponentLink12URL: https://datasheet.ciiva.com/17247/l0075s0083lqg15hn-17247093.pdf; ComponentLink12Description: https://datasheet.ciiva.com/17247/l0075s0083lqg15hn-17247093.pdf; ComponentLink13URL: https://datasheet.ciiva.com/18090/getdatasheetpartid-210549-18090181.pdf; ComponentLink13Description: https://datasheet.ciiva.com/18090/getdatasheetpartid-210549-18090181.pdf; ComponentLink14URL: https://datasheet.ciiva.com/8510/l0075s0083lqg15hn-8510908.pdf; ComponentLink14Description: https://datasheet.ciiva.com/8510/l0075s0083lqg15hn-8510908.pdf; ComponentLink15URL: https://datasheet.ciiva.com/5740/66026-5740734.pdf; ComponentLink15Description: https://datasheet.ciiva.com/5740/66026-5740734.pdf
L6 = L_0402_1.8nH: FIXED IND 1.8NH 950MA 100 MOHM; Manufacturer 1: Murata; Manufacturer Part Number 1: LQG15HS1N8S02D; Description 1: Inductor RF Chip Multi-Layer 1.8nH 0.3nH 100MHz 8Q-Factor Air 300mA 100mOhm DCR 0402 Paper T/R; Core Material: Air; Self Resonant Frequency: 6GHz; Current Rating: 300mA; Shielding: Unshielded; Q Factor: 8; DC Resistance (DCR): 100mR; Test Frequency: 100MHz; ComponentLink1URL: http://search.murata.co.jp/Ceramy/image/img/PDF/ENG/L0075S0084LQP15M.pdf; ComponentLink1Description: http://search.murata.co.jp/Ceramy/image/img/PDF/ENG/L0075S0084LQP15M.pdf; Supplier 1: Digi-Key; Supplier Part Number 1: 490-2613-6-ND; Stock 1: 67587; Pricing 1: 1=0.1, 10=0.056, 100=0.0376, 500=0.03136, 1000=0.02633, 2500=0.02257 (USD); Mount: Surface Mount; Case/Package: 0402; Case Code (Metric): 1005; Min Operating Temperature: -55°C; Max Operating Temperature: 125°C; Packaging: Tape and Reel; Package Quantity: 1; Max DC Current: 300mA; Termination: SMD/SMT; DC Current: 300mA; Military Standard: Not; Length: 0.039inch; Height: 0.5mm; Width: 0.02inch; Height - Seated (Max): 0.022inch; Depth: 0.55mm; Radiation Hardening: No; Lead Free: Lead Free; ComponentLink2URL: https://datasheet.ciiva.com/8510/l0075s0083lqg15hs-8510837.pdf; ComponentLink2Description: https://datasheet.ciiva.com/8510/l0075s0083lqg15hs-8510837.pdf; ComponentLink3URL: https://datasheet.ciiva.com/4977/o05e-4977799.pdf; ComponentLink3Description: https://datasheet.ciiva.com/4977/o05e-4977799.pdf; ComponentLink4URL: https://datasheet.ciiva.com/6690/l0075s0083lqg15hs-6690759.pdf; ComponentLink4Description: https://datasheet.ciiva.com/6690/l0075s0083lqg15hs-6690759.pdf; ComponentLink5URL: https://datasheet.ciiva.com/6690/l0075s0083lqg15hs-6690762.pdf; ComponentLink5Description: https://datasheet.ciiva.com/6690/l0075s0083lqg15hs-6690762.pdf; ComponentLink6URL: https://datasheet.ciiva.com/6690/l0075s0083lqg15hs-6690763.pdf; ComponentLink6Description: https://datasheet.ciiva.com/6690/l0075s0083lqg15hs-6690763.pdf; ComponentLink7URL: https://datasheet.ciiva.com/11801/0900766b80f10809-11801404.pdf; ComponentLink7Description: https://datasheet.ciiva.com/11801/0900766b80f10809-11801404.pdf; ComponentLink8URL: https://datasheet.ciiva.com/17247/l0075s0083lqg15hs-17247117.pdf; ComponentLink8Description: https://datasheet.ciiva.com/17247/l0075s0083lqg15hs-17247117.pdf
R70-R73 R86-R92 = R_0402_33: RES 33.0 OHM 1/16W 1% 0402 SMD; Manufacturer: Yageo; Manufacturer Part Number: RC0402FR-0733RL; Resistance (Ohms): 33; Temperature Coefficient: ±100ppm/°C; Supplier 1: Digi-Key; Supplier Part Number 1: 311-33.0LRCT-ND; RoHS: RoHS Compliant; Category: Resistors; Stock 1: 733920; Pricing: 10=0.014, 50=0.0104, 100=0.0079, 250=0.00584, 500=0.00432, 1000=0.00288 (USD); Composition: Thick Film; Features: -; Size / Dimension: 0.039" L x 0.020" W (1.00mm x 0.50mm); Height: 0.014" (0.35mm); Number of Terminations: 2; Packaging: Cut Tape (CT); Package / Case: 0402 (1005 Metric); ComponentLink1URL: http://www.yageo.com/documents/recent/PYu-RC0402_51_RoHS_L_6.pdf; ComponentLink1Description: http://www.yageo.com/documents/recent/PYu-RC0402_51_RoHS_L_6.pdf
R74 R77 R78 = R_0402_1.0K: as R51 on sheet SOM Power; Supplier 1: Digi-Key; Supplier Part Number 1: 311-1.00KLRCT-ND; RoHS: RoHS Compliant; Category: Resistors; Stock 1: 2103351; Pricing: 10=0.014, 100=0.0063, 500=0.00382, 1000=0.0027, 5000=0.00203 (USD); Composition: Thick Film; Features: -; Package / Case: 0402 (1005 Metric); Size / Dimension: 0.039" L x 0.020" W (1.00mm x 0.50mm); Height: 0.016" (0.40mm); Number of Terminations: 2; Packaging: Cut Tape (CT); ComponentLink1URL: http://www.yageo.com/documents/recent/PYu-RC0402_51_RoHS_L_6.pdf; ComponentLink1Description: http://www.yageo.com/documents/recent/PYu-RC0402_51_RoHS_L_6.pdf
R75 R76 = R_0402_100.0K: as R129 on sheet User Interface; RoHS: RoHS Compliant; Category: Resistors; Composition: Thick Film; Features: -; Lead Style: Surface Mount (SMD - SMT); Packaging: Cut Tape (CT); Resistance (Ohms): 100k; Package / Case: 0402 (1005 Metric); Supplier Device Package: 0402; Size / Dimension: 0.039" L x 0.020" W (1.00mm x 0.50mm); Height: 0.016" (0.40mm); Number of Terminations: 2; Supplier 1: Digi-Key; Supplier Part Number 1: RMCF0402FT100KCT-ND; Stock 1: 18746; Pricing: 1=0.04, 10=0.025, 50=0.0138, 100=0.0105, 250=0.0078, 500=0.00576, 1000=0.00384, 2500=0.00324, 5000=0.0027 (USD); ComponentLink1URL: http://www.seielect.com/Catalog/SEI-RMCF_RMCP.pdf; ComponentLink1Description: http://www.seielect.com/Catalog/SEI-RMCF_RMCP.pdf
R79-R85 = R_0402_10.0K: as R1-R5 on sheet SOM; Supplier 1: Digi-Key; Supplier Part Number 1: RMCF0402FT10K0CT-ND; RoHS: RoHS Compliant; Category: Resistors; Stock 1: 234525; Pricing: 1=0.04, 10=0.025, 50=0.0138, 100=0.0105, 250=0.0078, 500=0.00576, 1000=0.00384, 2500=0.00324, 5000=0.0027 (USD); Composition: Thick Film; Features: -; Package / Case: 0402 (1005 Metric); Size / Dimension: 0.039" L x 0.020" W (1.00mm x 0.50mm); Height: 0.016" (0.40mm); Number of Terminations: 2; Packaging: Cut Tape (CT); ComponentLink1URL: http://www.seielect.com/Catalog/SEI-RMCF_RMCP.pdf; ComponentLink1Description: http://www.seielect.com/Catalog/SEI-RMCF_RMCP.pdf
T17 T18 = TEST_POINT_SMALL: OSCILLOSCOPE TEST POINT
U6 = U_WL1837MODGIMOCT: WiLink Wi-Fi 2.4/5GHz MIMO BT/BLE; Sensitivity: -95dBm; Supplier 1: Digi-Key; Supplier Part Number 1: 296-43667-6-ND; Description 1: WiLink Wi-Fi 2.4/5GHz MIMO BT/BLE; Stock 1: 813; Pricing 1: 1=36.1, 10=33.321, 25=30.544, 100=28.23 (USD); Mount: Surface Mount; Case/Package: SMD/SMT; Min Operating Temperature: -40°C; Max Operating Temperature: 85°C; Packaging: Tape and Reel; Lead Free: Contains Lead; ComponentLink1URL: http://www.ti.com/lit/ds/symlink/wl1837mod.pdf; ComponentLink1Description: http://www.ti.com/lit/ds/symlink/wl1837mod.pdf
U7 = U_ASDK2-32.768KHZ-LR-T3: 32.768kHz CMOS XO (Standard) Oscillator Surface Mount 1.8V 1.5mA Enable/Disable; Supplier 1: Digi-Key; Supplier Part Number 1: 535-13597-6-ND; Description 1: 32.768kHz CMOS XO (Standard) Oscillator Surface Mount 1.8V 1.5mA Enable/Disable; Stock 1: 8834; Pricing 1: 1=1.39, 10=1.324, 50=1.2936, 100=1.1088, 500=1.078, 1000=0.9086 (USD); Mount: Surface Mount; Case/Package: SMD/SMT; Min Operating Temperature: -40°C; Max Operating Temperature: 85°C; Packaging: Cut Tape; Max Supply Current: 1.5mA; Length: 0.098inch; Height: 0.037inch; Width: 0.079inch; ComponentLink1URL: http://www.abracon.com/Oscillators/ASDK.pdf; ComponentLink1Description: http://www.abracon.com/Oscillators/ASDK.pdf